# EAGLE design GałązkaUkład (EAGLE 7.7.0)
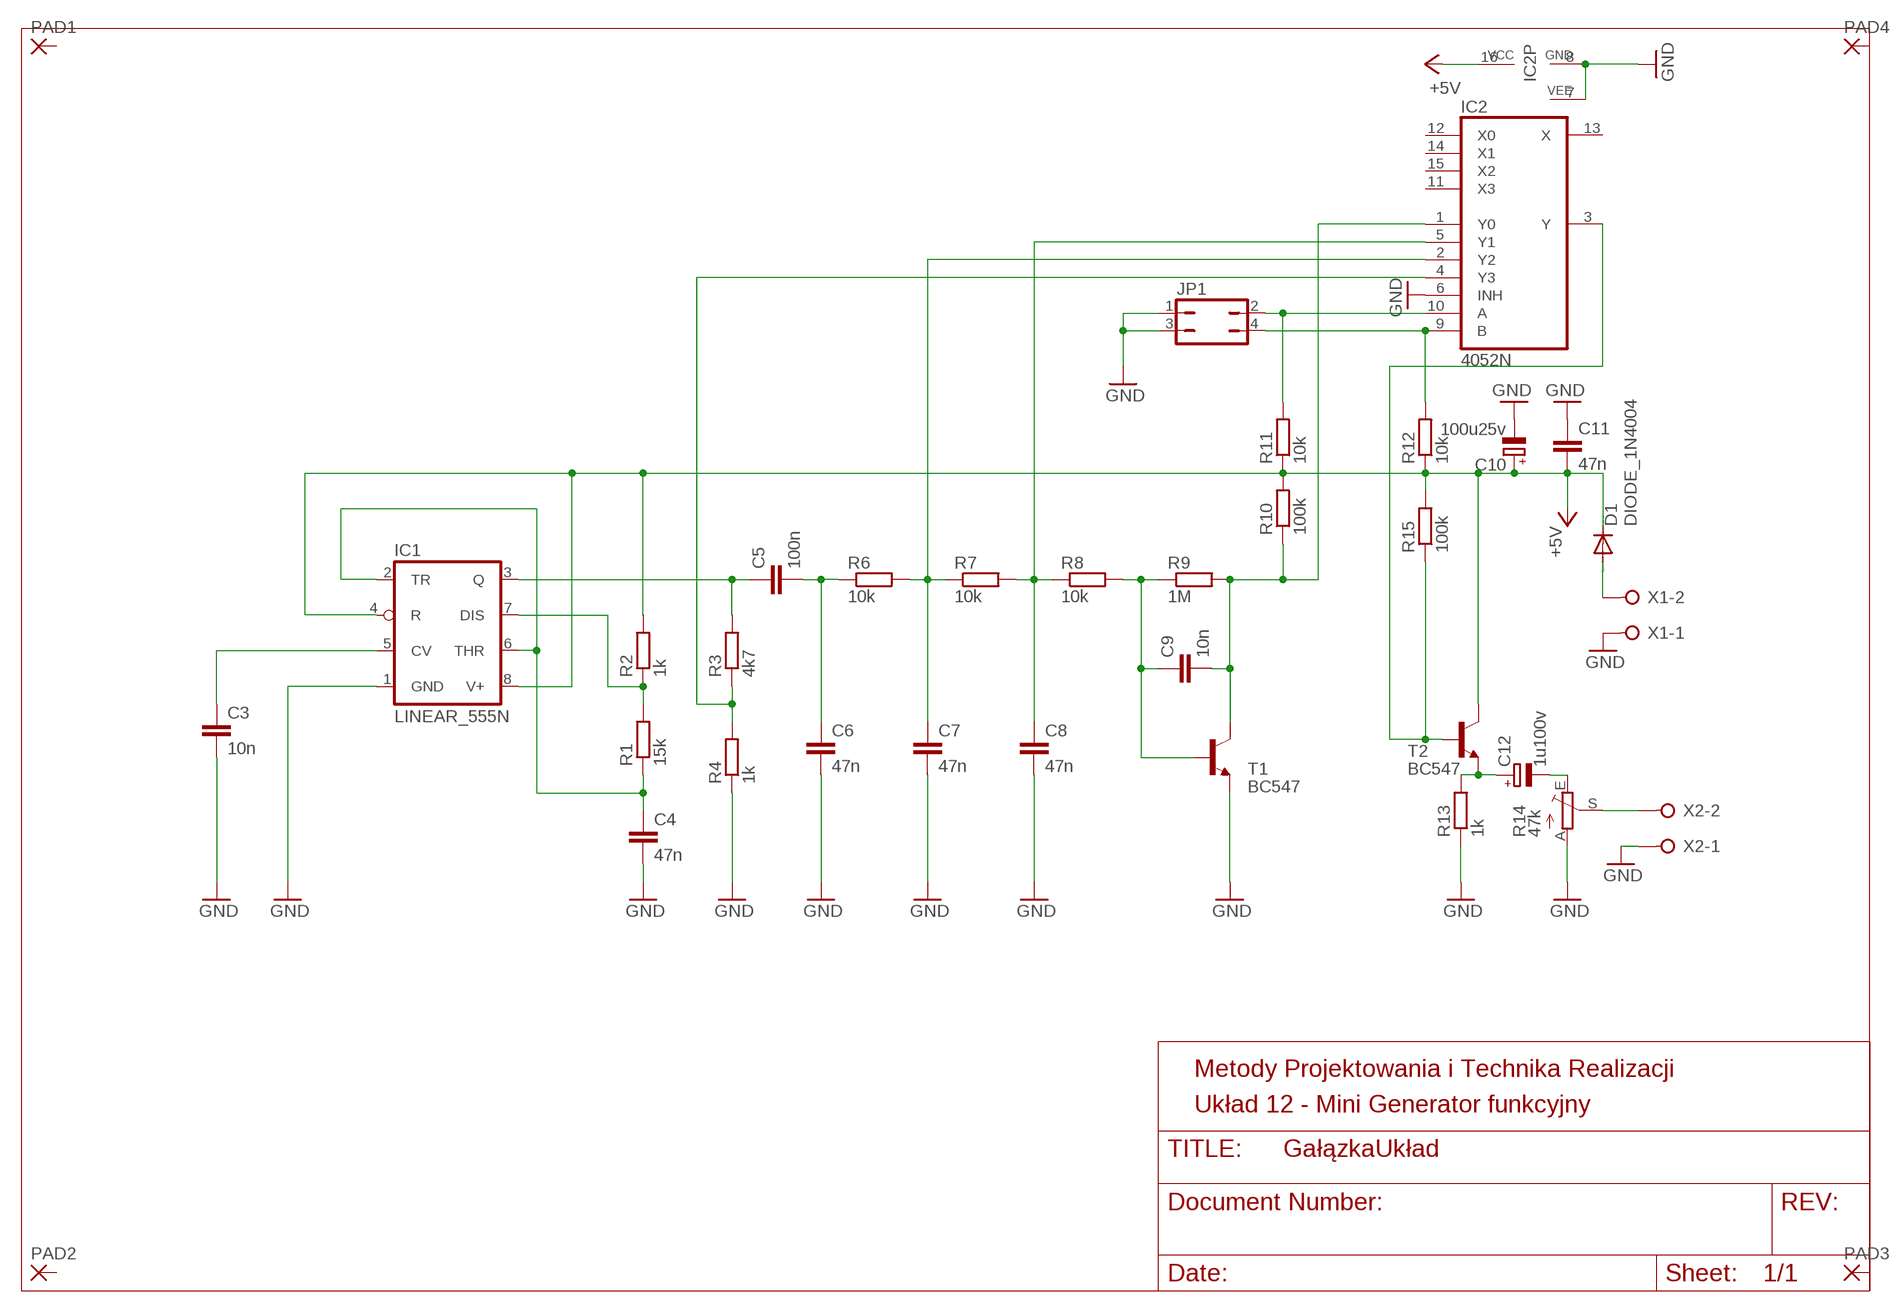
[diagram p0: schematic, sheet 1]

## Parts
C3  10n  C-EUC1206  [C1206]
C4  47n  C-EUC1206  [C1206]
C5  100n  C-EUC1206  [C1206]
C6  47n  C-EUC1206  [C1206]
C7  47n  C-EUC1206  [C1206]
C8  47n  C-EUC1206  [C1206]
C9  10n  C-EUC1206  [C1206]
C10  100u25v  RCL_CPOL-EUE2.5-6  [RCL_E2,5-6]
C11  47n  C-EUC1206  [C1206]
C12  1u100v  CPOL-EUE2-5  [E2-5]
D1  DIODE_1N4004  [DIODE_DO41-10]
IC1  LINEAR_555N  [LINEAR_DIL08]
IC2  4052N  [DIL16]
JP1  JUMPER_JP2Q  [JUMPER_JP2Q]
PAD1  2,54/1,1  [2,54/1,1]
PAD2  2,54/1,1  [2,54/1,1]
PAD3  2,54/1,1  [2,54/1,1]
PAD4  2,54/1,1  [2,54/1,1]
R1  15k  R-EU_R1206  [R1206]
R2  1k  R-EU_R1206  [R1206]
R3  4k7  R-EU_R1206  [R1206]
R4  1k  R-EU_R1206  [R1206]
R6  10k  R-EU_R1206  [R1206]
R7  10k  R-EU_R1206  [R1206]
R8  10k  R-EU_R1206  [R1206]
R9  1M  R-EU_R1206  [R1206]
R10  100k  R-EU_R1206  [R1206]
R11  10k  R-EU_R1206  [R1206]
R12  10k  R-EU_R1206  [R1206]
R13  1k  R-EU_R1206  [R1206]
R14  47k  POT_TRIM_EU-CA6V  [POT_CA6V]
R15  100k  R-EU_R1206  [R1206]
T1  BC547  [TO92]
T2  BC547  [TO92]
X1  CON-WAGO-508_W237-02P  [CON-WAGO-508_W237-132]
X2  CON-WAGO-508_W237-02P  [CON-WAGO-508_W237-132]

## Nets
+5V: C10.+ C11.2 D1.C IC1.4(R) IC1.8(V+) IC2.16(VCC) R2.2 R10.2 R11.1 R12.1 R15.2 T2.3(C)
C9: C9.2 IC2.1(Y0) R9.2 R10.1 T1.3(C)
GND: C3.2 C4.2 C6.2 C7.2 C8.2 C10.- C11.1 IC1.1(GND) IC2.6(INH) IC2.7(VEE) IC2.8(GND) JP1.1 JP1.3 R4.1 R13.1 R14.A T1.1(E) X1.1 X2.1
N$1: C5.2 C6.1 R6.1
N$2: C7.1 IC2.2(Y2) R6.2 R7.1
N$3: C8.1 IC2.5(Y1) R7.2 R8.1
N$4: C9.1 R8.2 R9.1 T1.2(B)
N$5: IC2.10(A) JP1.2 R11.2
N$6: C12.- R14.E
N$8: R14.S X2.2
N$9: IC2.9(B) JP1.4 R12.2
N$10: C5.1 IC1.3(Q) R3.2
N$11: C4.1 IC1.2(TR) IC1.6(THR) R1.1
N$12: IC1.7(DIS) R1.2 R2.1
N$14: C3.1 IC1.5(CV)
N$15: IC2.3(Y) R15.1 T2.2(B)
N$16: IC2.4(Y3) R3.1 R4.2
N$17: C12.+ R13.2 T2.1(E)
N$18: D1.A X1.2
Unconnected: IC2.11(X3) IC2.12(X0) IC2.13(X) IC2.14(X1) IC2.15(X2) PAD1.1(P) PAD2.1(P) PAD3.1(P) PAD4.1(P)

## Notes on the sheet
- Metody Projektowania i Technika Realizacji
- Układ 12 - Mini Generator funkcyjny

## Library data of the parts
C3-C9 C11 = rcl:C-EU: CAPACITOR, European symbol
C10 = Gryncewicz2:RCL_CPOL-EU: POLARIZED CAPACITOR, European symbol
C12 = rcl:CPOL-EU: POLARIZED CAPACITOR, European symbol
D1 = Gryncewicz2:DIODE_1N4004: DIODE general purpose rectifier, 1 A
IC1 = Gryncewicz2:LINEAR_*555: TIMER
IC2 = 40xx:4052: Dual 4-channel ANALOG MULTIPLEXER
JP1 = Gryncewicz2:JUMPER_JP2Q: JUMPER
PAD1-PAD4 = wirepad:2,54/1,1: THROUGH-HOLE PAD
R1-R4 R6-R13 R15 = rcl:R-EU_: RESISTOR, European symbol
R14 = Gryncewicz2:POT_TRIM_EU-: POTENTIOMETER
T1 T2 = transistor-neu-to92:BC547: NPN TRANSISTOR
X1 X2 = Gryncewicz2:CON-WAGO-508_W237-02P: WAGO SREW CLAMP; OC_FARNELL: unknown; OC_NEWARK: unknown

## Board
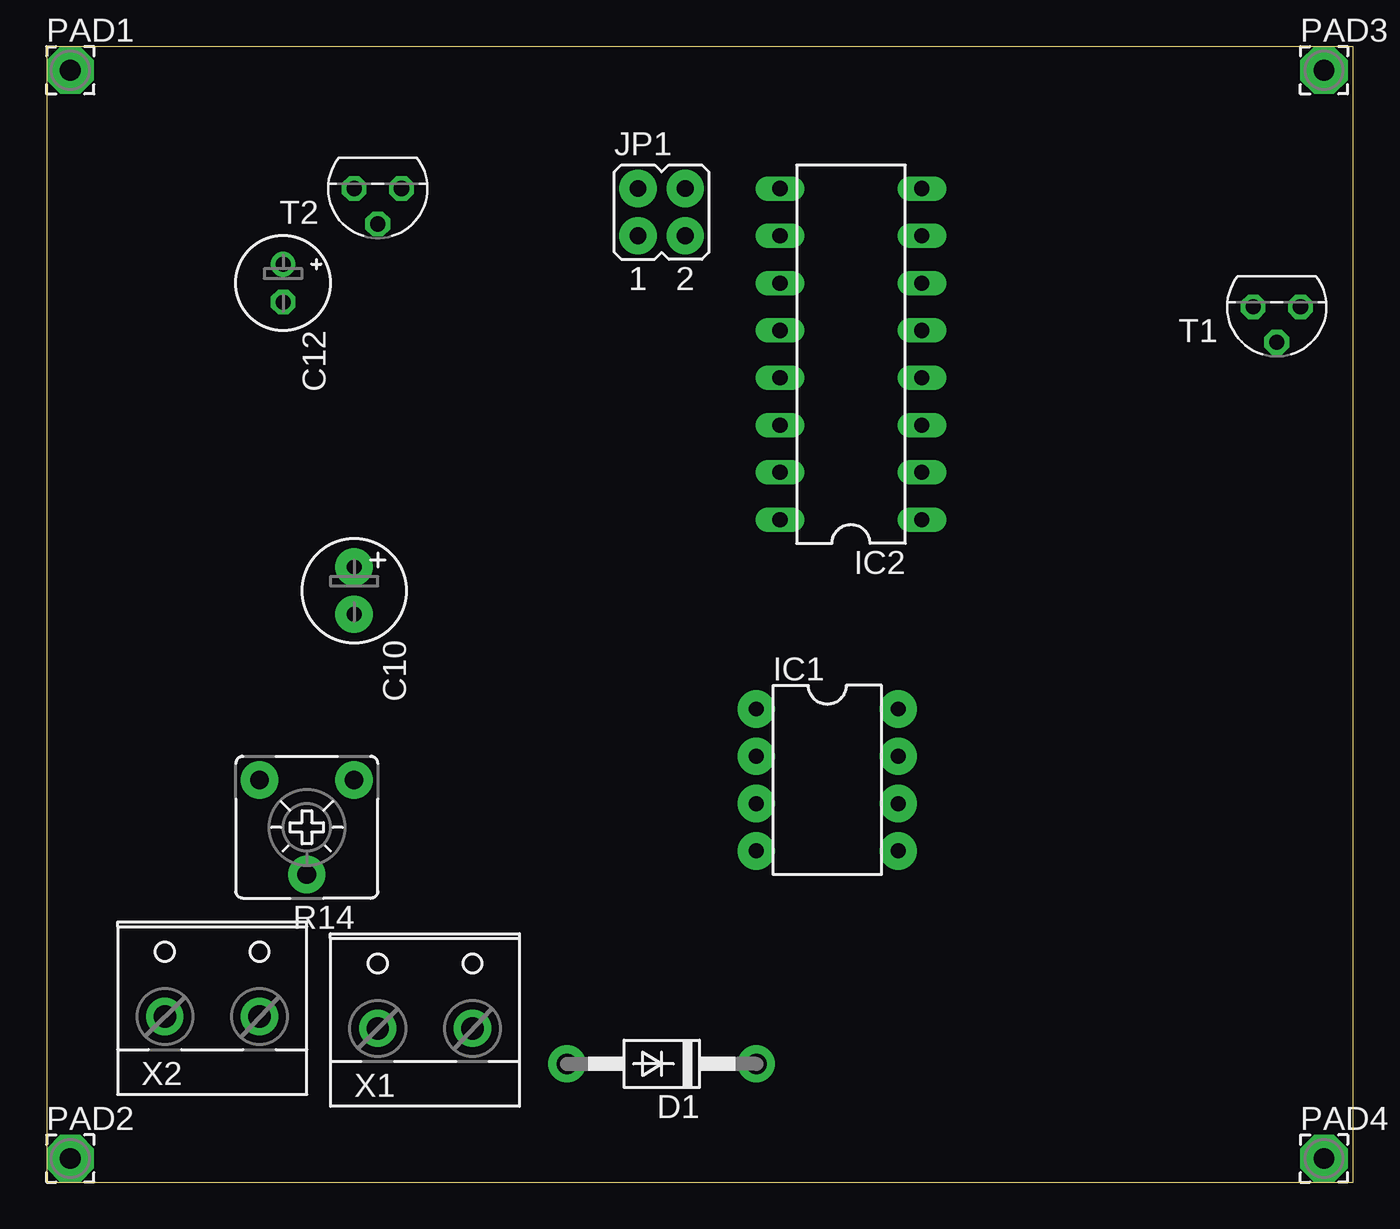
[diagram p1: board, top side]
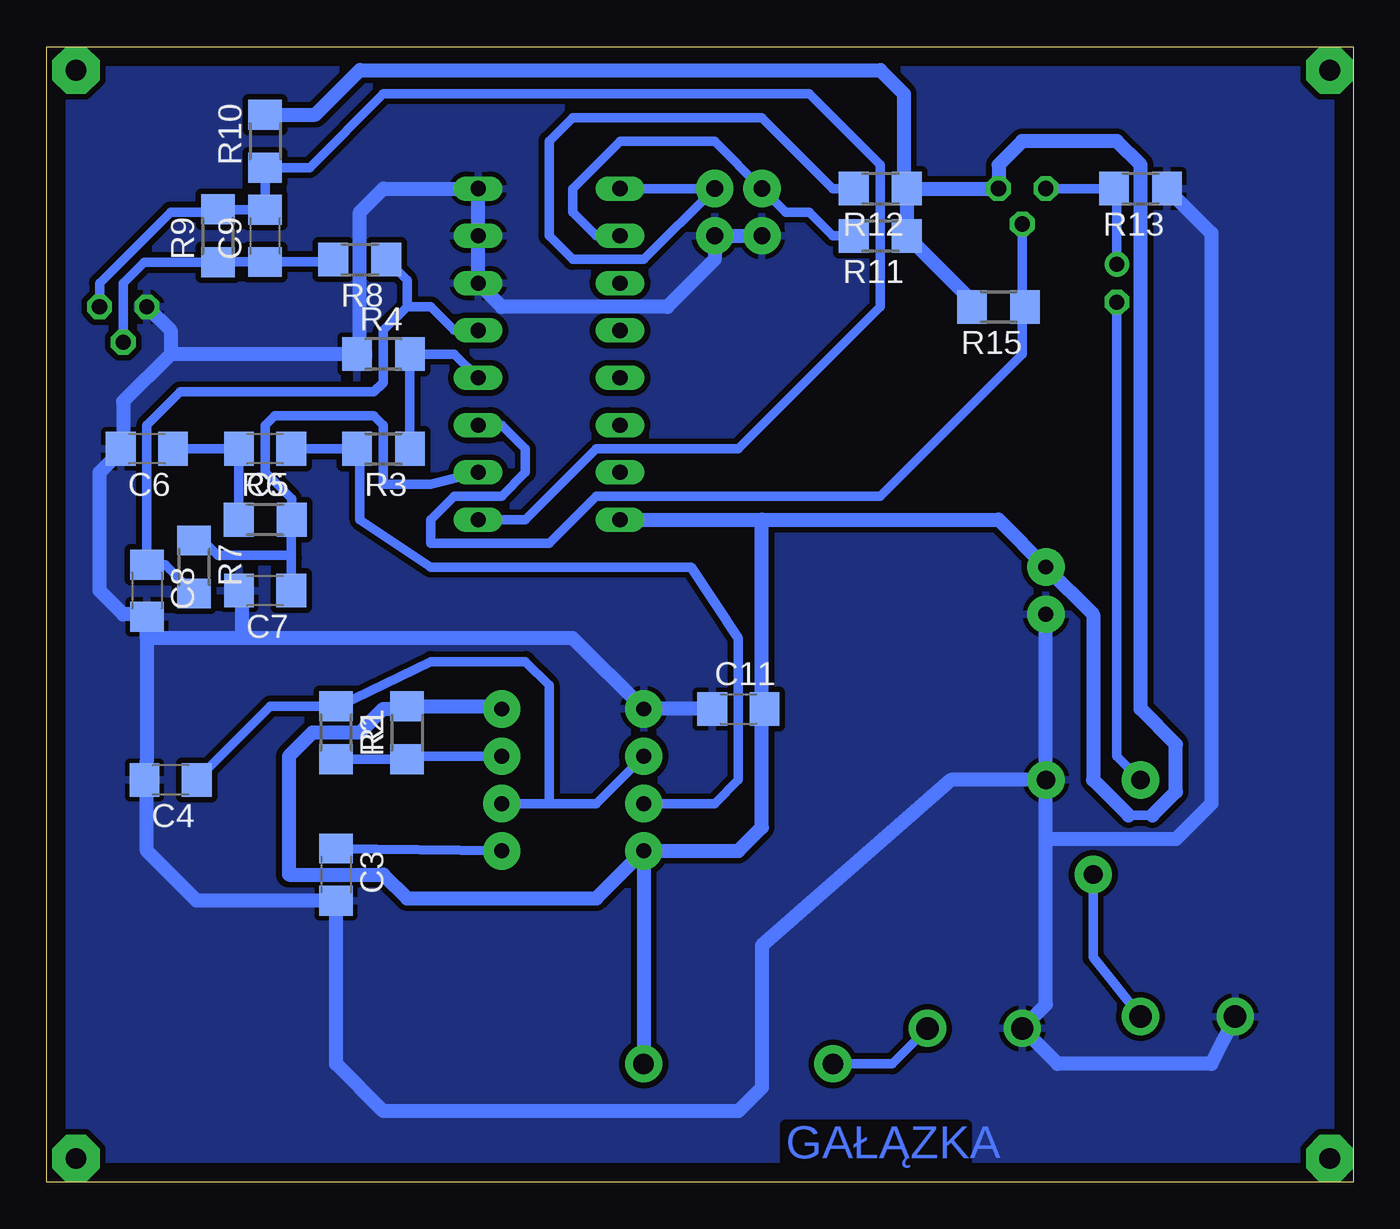
[diagram p2: board, bottom side, seen from below]

Size 70.16 x 60.95 mm. Coordinates in mm from the lower left corner, seen from the top.
Outline: 0,0 70.16,0 70.16,60.95 0,60.95 0,0
Copper layers (1*16): Top 0.035mm / dielectric 1.5mm / Bottom 0.035mm
Design rules "default *": minimum track width 10mil, minimum drill 24mil, track to track 12mil, track to pad 12mil, pad to pad 12mil, via to via 12mil, smd to smd 8mil, copper to edge 40mil, drill to drill 8mil, minimum pad ring 10mil, minimum via ring 8mil, stop-mask expansion 4mil, vias tented up to drill 0mil, thermal gap 10mil

### Footprints (pad centres in the part's own frame; a part is rotated, then mirrored left to right if it is on the bottom)
C1206 = smd 1.6 x 1.8: 1 -1.4,0; 2 1.4,0
RCL_E2,5-6 = drill 0.8 pad 2: + -1.27,0; - 1.27,0
E2-5 = drill 0.813 pad 1.27: + -1.016,0 | drill 0.813 pad 1.27 octagon: - 1.016,0
DIODE_DO41-10 = drill 1.1 pad 2: A 5.08,0; C -5.08,0
LINEAR_DIL08 = drill 0.8 pad 2: 1 -3.81,-3.81; 2 -1.27,-3.81; 3 1.27,-3.81; 4 3.81,-3.81; 5 3.81,3.81; 6 1.27,3.81; 7 -1.27,3.81; 8 -3.81,3.81
DIL16 = drill 0.813 long: 1 -8.89,-3.81; 2 -6.35,-3.81; 3 -3.81,-3.81; 4 -1.27,-3.81; 5 1.27,-3.81; 6 3.81,-3.81; 7 6.35,-3.81; 8 8.89,-3.81; 9 8.89,3.81; 10 6.35,3.81; 11 3.81,3.81; 12 1.27,3.81; 13 -1.27,3.81; 14 -3.81,3.81; 15 -6.35,3.81; 16 -8.89,3.81
JUMPER_JP2Q = drill 0.9 pad 2: 1 -1.27,-1.27; 2 -1.27,1.27; 3 1.27,-1.27; 4 1.27,1.27
2,54/1,1 = drill 1.118 pad 2.54 octagon: 1 0,0
R1206 = smd 1.6 x 1.803: 1 -1.422,0; 2 1.422,0
POT_CA6V = drill 1 pad 2: A -2.54,-2.54; E 2.54,-2.54; S 0,2.54
TO92 = drill 0.813 octagon: 1 1.27,0; 2 0,1.905; 3 -1.27,0
CON-WAGO-508_W237-132 = drill 1.2 pad 2: 1 -2.54,-0.635; 2 2.54,-0.635

### Placement (x,y rotation side)
C3  54.61,16.51 270 bottom
C4  63.5,21.59 180 bottom
C5  58.42,39.37 180 bottom
C6  64.77,39.37 180 bottom
C7  58.42,31.75 180 bottom
C8  64.77,31.75 270 bottom
C9  58.42,50.8 90 bottom
C10  16.51,31.75 270 top
C11  33.02,25.4 0 bottom
C12  12.7,48.26 270 top
D1  33.02,6.35 180 top
IC1  41.91,21.59 270 top
IC2  43.18,44.45 90 top
JP1  33.02,52.07 0 top
PAD1  1.27,59.69 0 top
PAD2  1.27,1.27 0 top
PAD3  68.58,59.69 0 top
PAD4  68.58,1.27 0 top
R1  54.61,24.13 270 bottom
R2  50.8,24.13 90 bottom
R3  52.07,39.37 180 bottom
R4  52.07,44.45 0 bottom
R6  58.42,35.56 0 bottom
R7  62.23,33.02 270 bottom
R8  53.34,49.53 180 bottom
R9  60.96,50.8 90 bottom
R10  58.42,55.88 90 bottom
R11  25.4,50.8 180 bottom
R12  25.4,53.34 180 bottom
R13  11.43,53.34 180 bottom
R14  13.97,19.05 180 top
R15  19.05,46.99 180 bottom
T1  66.04,46.99 180 top
T2  17.78,53.34 180 top
X1  20.32,8.89 0 top
X2  8.89,9.53 0 top

### Tracks (layer width: path | path; a pad name or v marks a point on that pad's centre or on a via)
+5V
  Bottom 0.508: 39.24,35.56 IC2.16 | 31.75,25.4 C11.2 31.75,25.27 | R15.2 20.47,47.29 | 12.06,19.68 10.79,19.68
  Bottom 0.762: R12.1 T2.3 19.05,54.61 17.78,55.88 12.7,55.88 11.43,54.61 11.43,25.4 9.53,23.5 9.53,20.95 10.79,19.68 | R12.1 R11.1 20.47,47.29 | IC1.4 D1.C | IC1.4 40.64,15.24 50.8,15.24 52.07,16.51 57.15,16.51 57.15,22.86 55.88,24.13 53.34,24.13 52.07,25.4 50.8,25.4 R2.2 45.72,25.55 IC1.8 | IC2.16 31.75,35.56 | 31.75,25.4 31.75,35.56 | IC1.4 33.02,17.78 31.75,19.05 31.75,25.27 | R10.2 55.73,57.3 53.34,59.69 25.4,59.69 24.13,58.42 24.13,53.49 R12.1 | 31.75,35.56 19.05,35.56 C10.+ 13.97,30.48 13.97,21.59 12.06,19.68
C9
  Bottom 0.508: T1.3 67.31,48.26 63.5,52.07 61.11,52.07 R9.2 60.94,52.2 C9.2 R10.1 56.03,54.46 52.07,58.42 29.21,58.42 25.4,54.61 25.4,46.99 33.02,39.37 40.64,39.37 44.45,35.56 IC2.1
GND
  Bottom 0.508: 66.04,39.5 C6.2 66.17,39.24 | C7.2 59.69,31.62 | C8.2 64.9,30.48 | R4.1 53.34,44.6
  Bottom 0.762: JP1.1 JP1.3 34.29,49.53 36.83,46.99 45.72,46.99 IC2.6 IC2.7 IC2.8 52.07,53.34 53.34,52.07 53.34,44.6 | R4.1 63.5,44.45 | 63.5,44.45 66.04,41.91 66.04,39.5 | T1.1 63.5,45.72 63.5,44.45 | X2.1 7.62,6.35 15.88,6.35 X1.1 16.51,9.53 16.51,18.41 | 16.51,18.41 R14.A | R14.A C10.- | R14.A 21.59,21.59 31.75,12.7 31.75,5.08 33.02,3.81 52.07,3.81 54.61,6.35 C3.2 62.1,15.11 64.77,17.78 64.77,21.46 C4.2 64.77,22.73 64.77,29.21 | R13.1 7.62,50.95 7.62,20.32 9.53,18.41 16.51,18.41 | C11.1 IC1.1 41.91,29.21 59.69,29.21 | 59.69,29.21 64.77,29.21 | 64.77,29.21 C8.2 | 59.69,31.62 59.69,29.21 | 64.9,30.48 66.04,30.48 67.31,31.75 67.31,38.1 66.17,39.24
  pour Bottom (isolate 0.127): 0,60.96 0,0 69.85,0 69.85,60.96
N$1
  Bottom 0.508: C6.1 C5.2 59.84,39.35 R6.1
N$2
  Bottom 0.508: C7.1 57.02,33.53 | 57.02,33.53 57.02,35.54 R6.2 57,36.68 58.42,38.1 58.42,40.64 57.91,41.15 52.58,41.15 52.07,40.64 52.07,37.47 49.53,37.47 IC2.2 | 62.23,34.29 R7.1 61.75,34.44 60.96,33.66 57.15,33.66 57.02,33.53
N$3
  Bottom 0.508: 50.8,46.99 52.07,45.72 52.07,42.93 52.58,42.42 62.99,42.42 64.77,40.64 C8.1 63.78,33.15 R7.2 | 50.8,46.99 49.53,46.99 48.26,45.72 IC2.5 | R8.1 50.8,48.41 50.8,46.99
N$4
  Bottom 0.508: R8.2 54.89,49.4 C9.1 60.94,49.4 R9.1 64.92,49.38 66.04,48.26 T1.2
N$5
  Bottom 0.508: IC2.10 40.64,50.8 41.91,52.07 41.91,53.34 39.37,55.88 34.29,55.88 JP1.2 30.48,52.07 29.21,52.07 27.94,50.8 R11.2
N$6
  Bottom 0.508: R14.E 12.7,22.86 C12.-
N$8
  Bottom 0.508: X2.2 13.97,12.06 R14.S
N$9
  Bottom 0.508: IC2.9 JP1.4 38.1,49.53 41.91,49.53 43.18,50.8 43.18,55.88 41.91,57.15 31.75,57.15 27.94,53.34 R12.2
N$10
  Bottom 0.508: C5.1 R3.2 53.34,39.22 53.34,35.56 49.53,33.02 35.56,33.02 33.02,29.21 33.02,21.59 34.29,20.32 IC1.3
N$11
  Bottom 0.508: IC1.6 43.18,20.32 | 43.18,20.32 40.64,20.32 IC1.2 | 43.18,20.32 43.18,26.67 44.45,27.94 49.53,27.94 54.46,25.55 R1.1 58.14,25.55 C4.1
N$12
  Bottom 0.508: IC1.7 50.65,22.86 R2.1 R1.2
N$14
  Bottom 0.508: IC1.5 C3.1
N$15
  Bottom 0.508: IC2.3 45.72,40.64 44.45,39.37 44.45,38.1 45.72,36.83 48.26,36.83 49.53,35.56 49.53,34.29 43.18,34.29 40.64,36.83 25.4,36.83 17.78,44.45 17.78,46.84 R15.1 17.78,47.14 T2.2
N$16
  Bottom 0.508: R3.1 R4.2 48.26,44.45 IC2.4
N$17
  Bottom 0.508: T2.1 R13.2 12.7,53.19 C12.+
N$18
  Bottom 0.508: X1.2 24.77,6.35 D1.A

### Text on the board
Bottom: GAŁĄZKA